# Altium schematic sheet RFR24 AMS Design - Top Level V1.SchDoc
size A; SheetNumber: 1; SheetTotal: 10
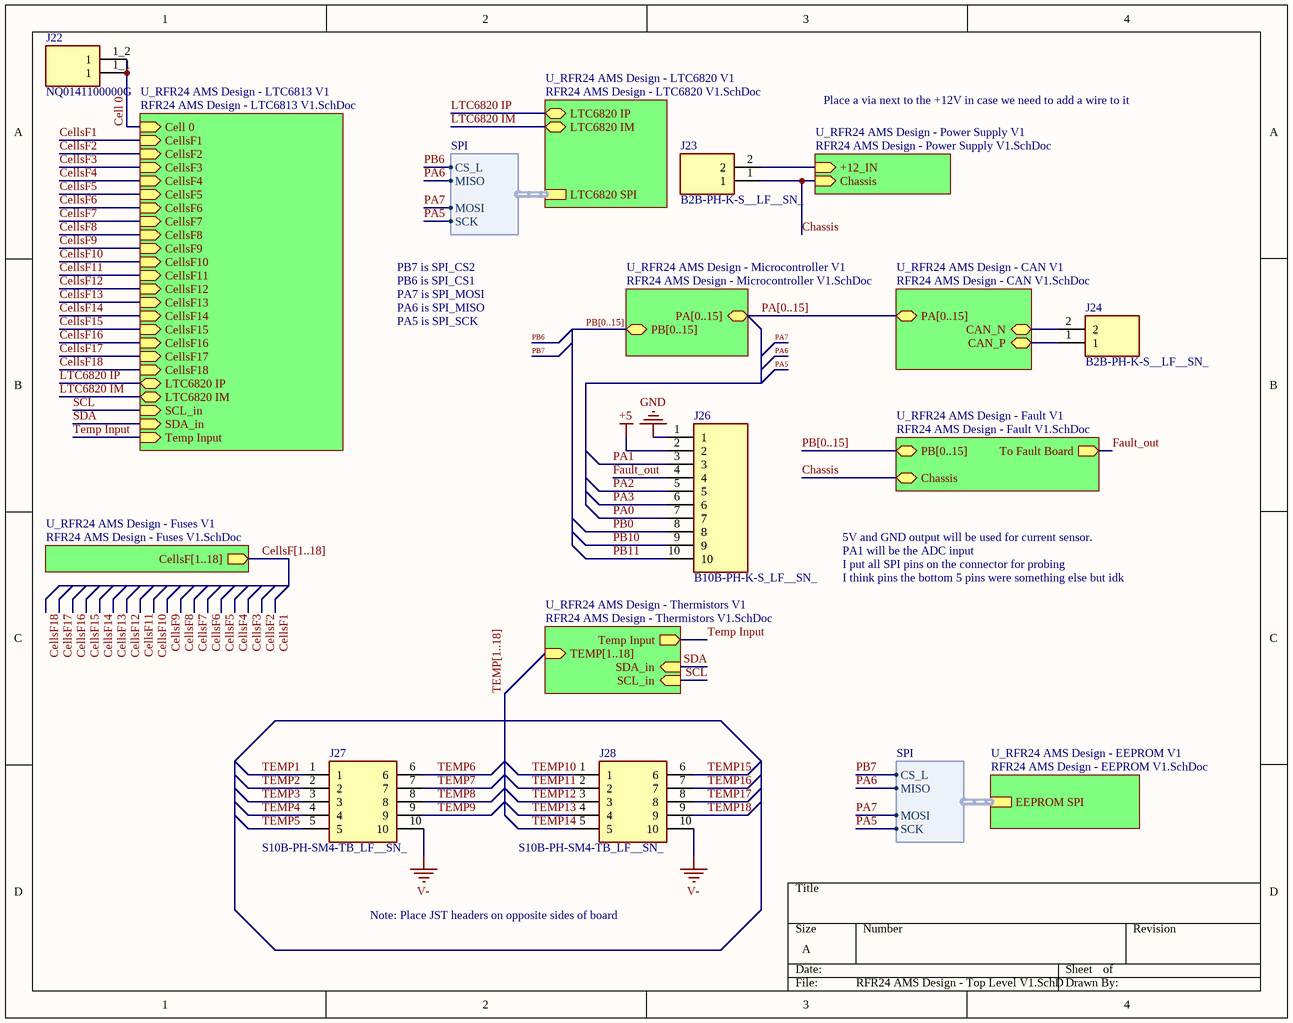
[diagram p0: RFR24 AMS Design - Top Level V1.SchDoc]

## Parts
J22  NQ0141100000G  [AMPHENOL_NQ0141100000G]
J23  B2B-PH-K-S__LF__SN_  [B2BPHKSLFSN]
J24  B2B-PH-K-S__LF__SN_  [B2BPHKSLFSN]
J26  B10B-PH-K-S_LF__SN_  [SHDR10W50P0X200_1X10_2190X450X600P]
J27  S10B-PH-SM4-TB_LF__SN_  [S10B-PH-SM4-TB]
J28  S10B-PH-SM4-TB_LF__SN_  [S10B-PH-SM4-TB]

## Sub-sheets
U_RFR24 AMS Design - CAN V1 = RFR24 AMS Design - CAN V1.SchDoc: PA[0..15] (bidir), CAN_N (bidir), CAN_P (bidir)
U_RFR24 AMS Design - EEPROM V1 = RFR24 AMS Design - EEPROM V1.SchDoc: EEPROM SPI (harness SPI)
U_RFR24 AMS Design - Fault V1 = RFR24 AMS Design - Fault V1.SchDoc: To Fault Board (out), Chassis (bidir), PB[0..15] (bidir)
U_RFR24 AMS Design - Fuses V1 = RFR24 AMS Design - Fuses V1.SchDoc: CellsF[1..18] (out)
U_RFR24 AMS Design - LTC6813 V1 = RFR24 AMS Design - LTC6813 V1.SchDoc: LTC6820 IP (bidir), LTC6820 IM (bidir), SCL_in (in), SDA_in (in), Cell 0 (in), CellsF1 (in), CellsF2 (in), CellsF3 (in), CellsF4 (in), CellsF5 (in), CellsF6 (in), CellsF7 (in), CellsF8 (in), CellsF9 (in), CellsF10 (in), CellsF11 (in), CellsF12 (in), CellsF13 (in), CellsF14 (in), CellsF15 (in), CellsF16 (in), CellsF17 (in), CellsF18 (in), Temp Input (in)
U_RFR24 AMS Design - LTC6820 V1 = RFR24 AMS Design - LTC6820 V1.SchDoc: LTC6820 IP (bidir), LTC6820 IM (bidir), LTC6820 SPI (harness SPI)
U_RFR24 AMS Design - Microcontroller V1 = RFR24 AMS Design - Microcontroller V1.SchDoc: PA[0..15] (bidir), PB[0..15] (bidir)
U_RFR24 AMS Design - Power Supply V1 = RFR24 AMS Design - Power Supply V1.SchDoc: +12_IN (in), Chassis (in)
U_RFR24 AMS Design - Thermistors V1 = RFR24 AMS Design - Thermistors V1.SchDoc: SDA_in (in), SCL_in (in), TEMP[1..18] (in), Temp Input (out)

## Harnesses
SPI: CS_L, MISO, MOSI, SCK

## Nets
+5: J26.2
GND: J26.1
V-: J27.10 J28.10
Cell 0: J22.1_1(1) J22.1_2(1) ; sheet U_RFR24 AMS Design - LTC6813 V1/Cell 0
CellsF1: sheet U_RFR24 AMS Design - LTC6813 V1/CellsF1
CellsF2: sheet U_RFR24 AMS Design - LTC6813 V1/CellsF2
CellsF3: sheet U_RFR24 AMS Design - LTC6813 V1/CellsF3
CellsF4: sheet U_RFR24 AMS Design - LTC6813 V1/CellsF4
CellsF5: sheet U_RFR24 AMS Design - LTC6813 V1/CellsF5
CellsF6: sheet U_RFR24 AMS Design - LTC6813 V1/CellsF6
CellsF7: sheet U_RFR24 AMS Design - LTC6813 V1/CellsF7
CellsF8: sheet U_RFR24 AMS Design - LTC6813 V1/CellsF8
CellsF9: sheet U_RFR24 AMS Design - LTC6813 V1/CellsF9
CellsF10: sheet U_RFR24 AMS Design - LTC6813 V1/CellsF10
CellsF11: sheet U_RFR24 AMS Design - LTC6813 V1/CellsF11
CellsF12: sheet U_RFR24 AMS Design - LTC6813 V1/CellsF12
CellsF13: sheet U_RFR24 AMS Design - LTC6813 V1/CellsF13
CellsF14: sheet U_RFR24 AMS Design - LTC6813 V1/CellsF14
CellsF15: sheet U_RFR24 AMS Design - LTC6813 V1/CellsF15
CellsF16: sheet U_RFR24 AMS Design - LTC6813 V1/CellsF16
CellsF17: sheet U_RFR24 AMS Design - LTC6813 V1/CellsF17
CellsF18: sheet U_RFR24 AMS Design - LTC6813 V1/CellsF18
Chassis: J23.1 ; sheet U_RFR24 AMS Design - Power Supply V1/Chassis, sheet U_RFR24 AMS Design - Fault V1/Chassis
Fault_out: J26.4 ; sheet U_RFR24 AMS Design - Fault V1/To Fault Board
LTC6820 IM: sheet U_RFR24 AMS Design - LTC6813 V1/LTC6820 IM, sheet U_RFR24 AMS Design - LTC6820 V1/LTC6820 IM
LTC6820 IP: sheet U_RFR24 AMS Design - LTC6813 V1/LTC6820 IP, sheet U_RFR24 AMS Design - LTC6820 V1/LTC6820 IP
PA0: J26.7
PA1: J26.3
PA2: J26.5
PA3: J26.6
PA5: sheet U_RFR24 AMS Design - LTC6820 V1/LTC6820 SPI.SCK, sheet U_RFR24 AMS Design - EEPROM V1/EEPROM SPI.SCK
PA6: sheet U_RFR24 AMS Design - LTC6820 V1/LTC6820 SPI.MISO, sheet U_RFR24 AMS Design - EEPROM V1/EEPROM SPI.MISO
PA7: sheet U_RFR24 AMS Design - LTC6820 V1/LTC6820 SPI.MOSI, sheet U_RFR24 AMS Design - EEPROM V1/EEPROM SPI.MOSI
PB0: J26.8
PB6: sheet U_RFR24 AMS Design - LTC6820 V1/LTC6820 SPI.CS_L
PB7: sheet U_RFR24 AMS Design - EEPROM V1/EEPROM SPI.CS_L
PB10: J26.9
PB11: J26.10
SCL: sheet U_RFR24 AMS Design - LTC6813 V1/SCL_in, sheet U_RFR24 AMS Design - Thermistors V1/SCL_in
SDA: sheet U_RFR24 AMS Design - LTC6813 V1/SDA_in, sheet U_RFR24 AMS Design - Thermistors V1/SDA_in
TEMP1: J27.1
TEMP2: J27.2
TEMP3: J27.3
TEMP4: J27.4
TEMP5: J27.5
TEMP6: J27.6
TEMP7: J27.7
TEMP8: J27.8
TEMP9: J27.9
TEMP10: J28.1
TEMP11: J28.2
TEMP12: J28.3
TEMP13: J28.4
TEMP14: J28.5
TEMP15: J28.6
TEMP16: J28.7
TEMP17: J28.8
TEMP18: J28.9
Temp Input: sheet U_RFR24 AMS Design - LTC6813 V1/Temp Input, sheet U_RFR24 AMS Design - Thermistors V1/Temp Input
NetJ23_2: J23.2 ; sheet U_RFR24 AMS Design - Power Supply V1/+12_IN
NetJ24_1: J24.1 ; sheet U_RFR24 AMS Design - CAN V1/CAN_P
NetJ24_2: J24.2 ; sheet U_RFR24 AMS Design - CAN V1/CAN_N

## Buses and harness runs
bus CellsF[1..18] = sheet U_RFR24 AMS Design - Fuses V1/CellsF[1..18]
bus PA[0..15] = sheet U_RFR24 AMS Design - CAN V1/PA[0..15] = sheet U_RFR24 AMS Design - Microcontroller V1/PA[0..15]
bus PB[0..15] = sheet U_RFR24 AMS Design - Fault V1/PB[0..15]
bus PB[0..15] = sheet U_RFR24 AMS Design - Microcontroller V1/PB[0..15]
bus TEMP[1..18] = sheet U_RFR24 AMS Design - Thermistors V1/TEMP[1..18]

## Notes on the sheet
- Place a via next to the +12V in case we need to add a wire to it
- PA7 is SPI_MOSI
- PB6 is SPI_CS1
- PB7 is SPI_CS2
- PA5 is SPI_SCK
- PA6 is SPI_MISO
- 5V and GND output will be used for current sensor.
- PA1 will be the ADC input
- I put all SPI pins on the connector for probing
- I think pins the bottom 5 pins were something else but idk
- Note: Place JST headers on opposite sides of board

## Library data of the parts
J22 = NQ0141100000G: 1 Position Wire to Board Terminal Block Horizontal with Board Surface Mount; MF: Amphenol Anytek; Package: None; Check_prices: https://www.snapeda.com/parts/NQ0141100000G/Amphenol/view-part/?ref=eda; Availability: In Stock; Value: *; MP: NQ0141100000G; SnapEDA_Link: https://www.snapeda.com/parts/NQ0141100000G/Amphenol/view-part/?ref=snap; Price: None; Purchase-URL: https://pricing.snapeda.com/search/part/NQ0141100000G/?ref=eda
J23 J24 = B2B-PH-K-S__LF__SN_: Circulator or Directional Coupler; Manufacturer_Name: JST (JAPAN SOLDERLESS TERMINALS); Manufacturer_Part_Number: B2B-PH-K-S (LF)(SN); Datasheet Link: http://www.jst-mfg.com/product/pdf/eng/ePH.pdf; Height: 6mm
J26 = B10B-PH-K-S_LF__SN_: Connector; Manufacturer_Name: JST (JAPAN SOLDERLESS TERMINALS); Manufacturer_Part_Number: B10B-PH-K-S(LF)(SN); Datasheet Link: http://uk.rs-online.com/web/p/products/8201428; Height: 6mm; Arrow Part Number: B10B-PH-K-S(LF)(SN); Arrow Price/Stock: https://www.arrow.com/en/products/b10b-ph-k-s-lf-sn/jst-manufacturing?region=europe
J27 J28 = S10B-PH-SM4-TB_LF__SN_: Connector; Manufacturer_Name: JST (JAPAN SOLDERLESS TERMINALS); Manufacturer_Part_Number: S10B-PH-SM4-TB(LF)(SN); Datasheet Link: http://uk.rs-online.com/web/p/products/6881350; Arrow Part Number: S10B-PH-SM4-TB(LF)(SN); Arrow Price/Stock: https://www.arrow.com/en/products/s10b-ph-sm4-tb-lf-sn/jst-manufacturing?region=nac